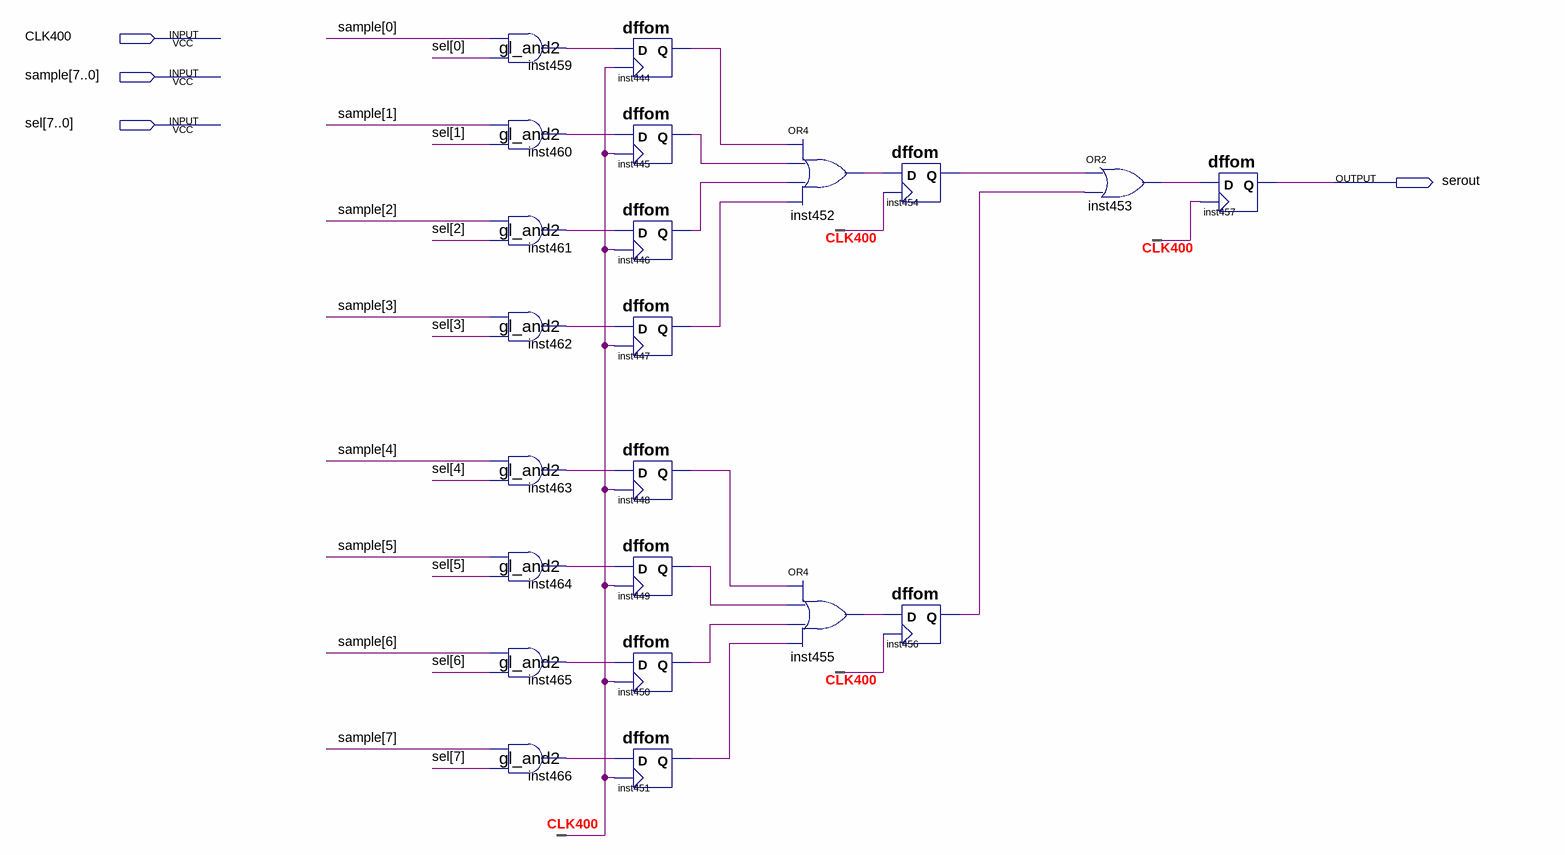
[diagram p0: schematic sheet]
// Quartus schematic phase_selector.bdf as structural Verilog: 22 symbols, 4 pins
module phase_selector (
  input  CLK400,
  input  [7:0] sample,
  input  [7:0] sel,
  output serout
);

  wire inst444_q, inst445_q, inst446_q, inst447_q, inst448_q, inst449_q, inst450_q, inst451_q, inst452_out,
       inst453_out, inst454_q, inst455_out, inst456_q, inst459_result, inst460_result, inst461_result,
       inst462_result, inst463_result, inst464_result, inst465_result, inst466_result;

  gl_and2 inst459 (.data0(sample[0]), .data1(sel[0]), .result(inst459_result));
  gl_and2 inst460 (.data0(sample[1]), .data1(sel[1]), .result(inst460_result));
  gl_and2 inst461 (.data0(sample[2]), .data1(sel[2]), .result(inst461_result));
  gl_and2 inst462 (.data0(sample[3]), .data1(sel[3]), .result(inst462_result));
  gl_and2 inst463 (.data0(sample[4]), .data1(sel[4]), .result(inst463_result));
  gl_and2 inst464 (.data0(sample[5]), .data1(sel[5]), .result(inst464_result));
  gl_and2 inst465 (.data0(sample[6]), .data1(sel[6]), .result(inst465_result));
  gl_and2 inst466 (.data0(sample[7]), .data1(sel[7]), .result(inst466_result));
  dffom inst444 (.D(inst459_result), .CK(CLK400), .Q(inst444_q));
  dffom inst445 (.D(inst460_result), .CK(CLK400), .Q(inst445_q));
  dffom inst446 (.D(inst461_result), .CK(CLK400), .Q(inst446_q));
  dffom inst447 (.D(inst462_result), .CK(CLK400), .Q(inst447_q));
  dffom inst448 (.D(inst463_result), .CK(CLK400), .Q(inst448_q));
  dffom inst449 (.D(inst464_result), .CK(CLK400), .Q(inst449_q));
  dffom inst450 (.D(inst465_result), .CK(CLK400), .Q(inst450_q));
  dffom inst451 (.D(inst466_result), .CK(CLK400), .Q(inst451_q));
  or inst452 (inst452_out, inst444_q, inst445_q, inst446_q, inst447_q);
  or inst455 (inst455_out, inst448_q, inst449_q, inst450_q, inst451_q);
  dffom inst454 (.D(inst452_out), .CK(CLK400), .Q(inst454_q));
  dffom inst456 (.D(inst455_out), .CK(CLK400), .Q(inst456_q));
  or inst453 (inst453_out, inst454_q, inst456_q);
  dffom inst457 (.D(inst453_out), .CK(CLK400), .Q(serout));
endmodule
